# EasyEDA schematic Schematic.json
TITLE: Sheet_1; REV: 1.0; Date: 2025-03-10; Sheet: 1/1; Drawn By: beckett.gregory.taylor; Company: Your Company
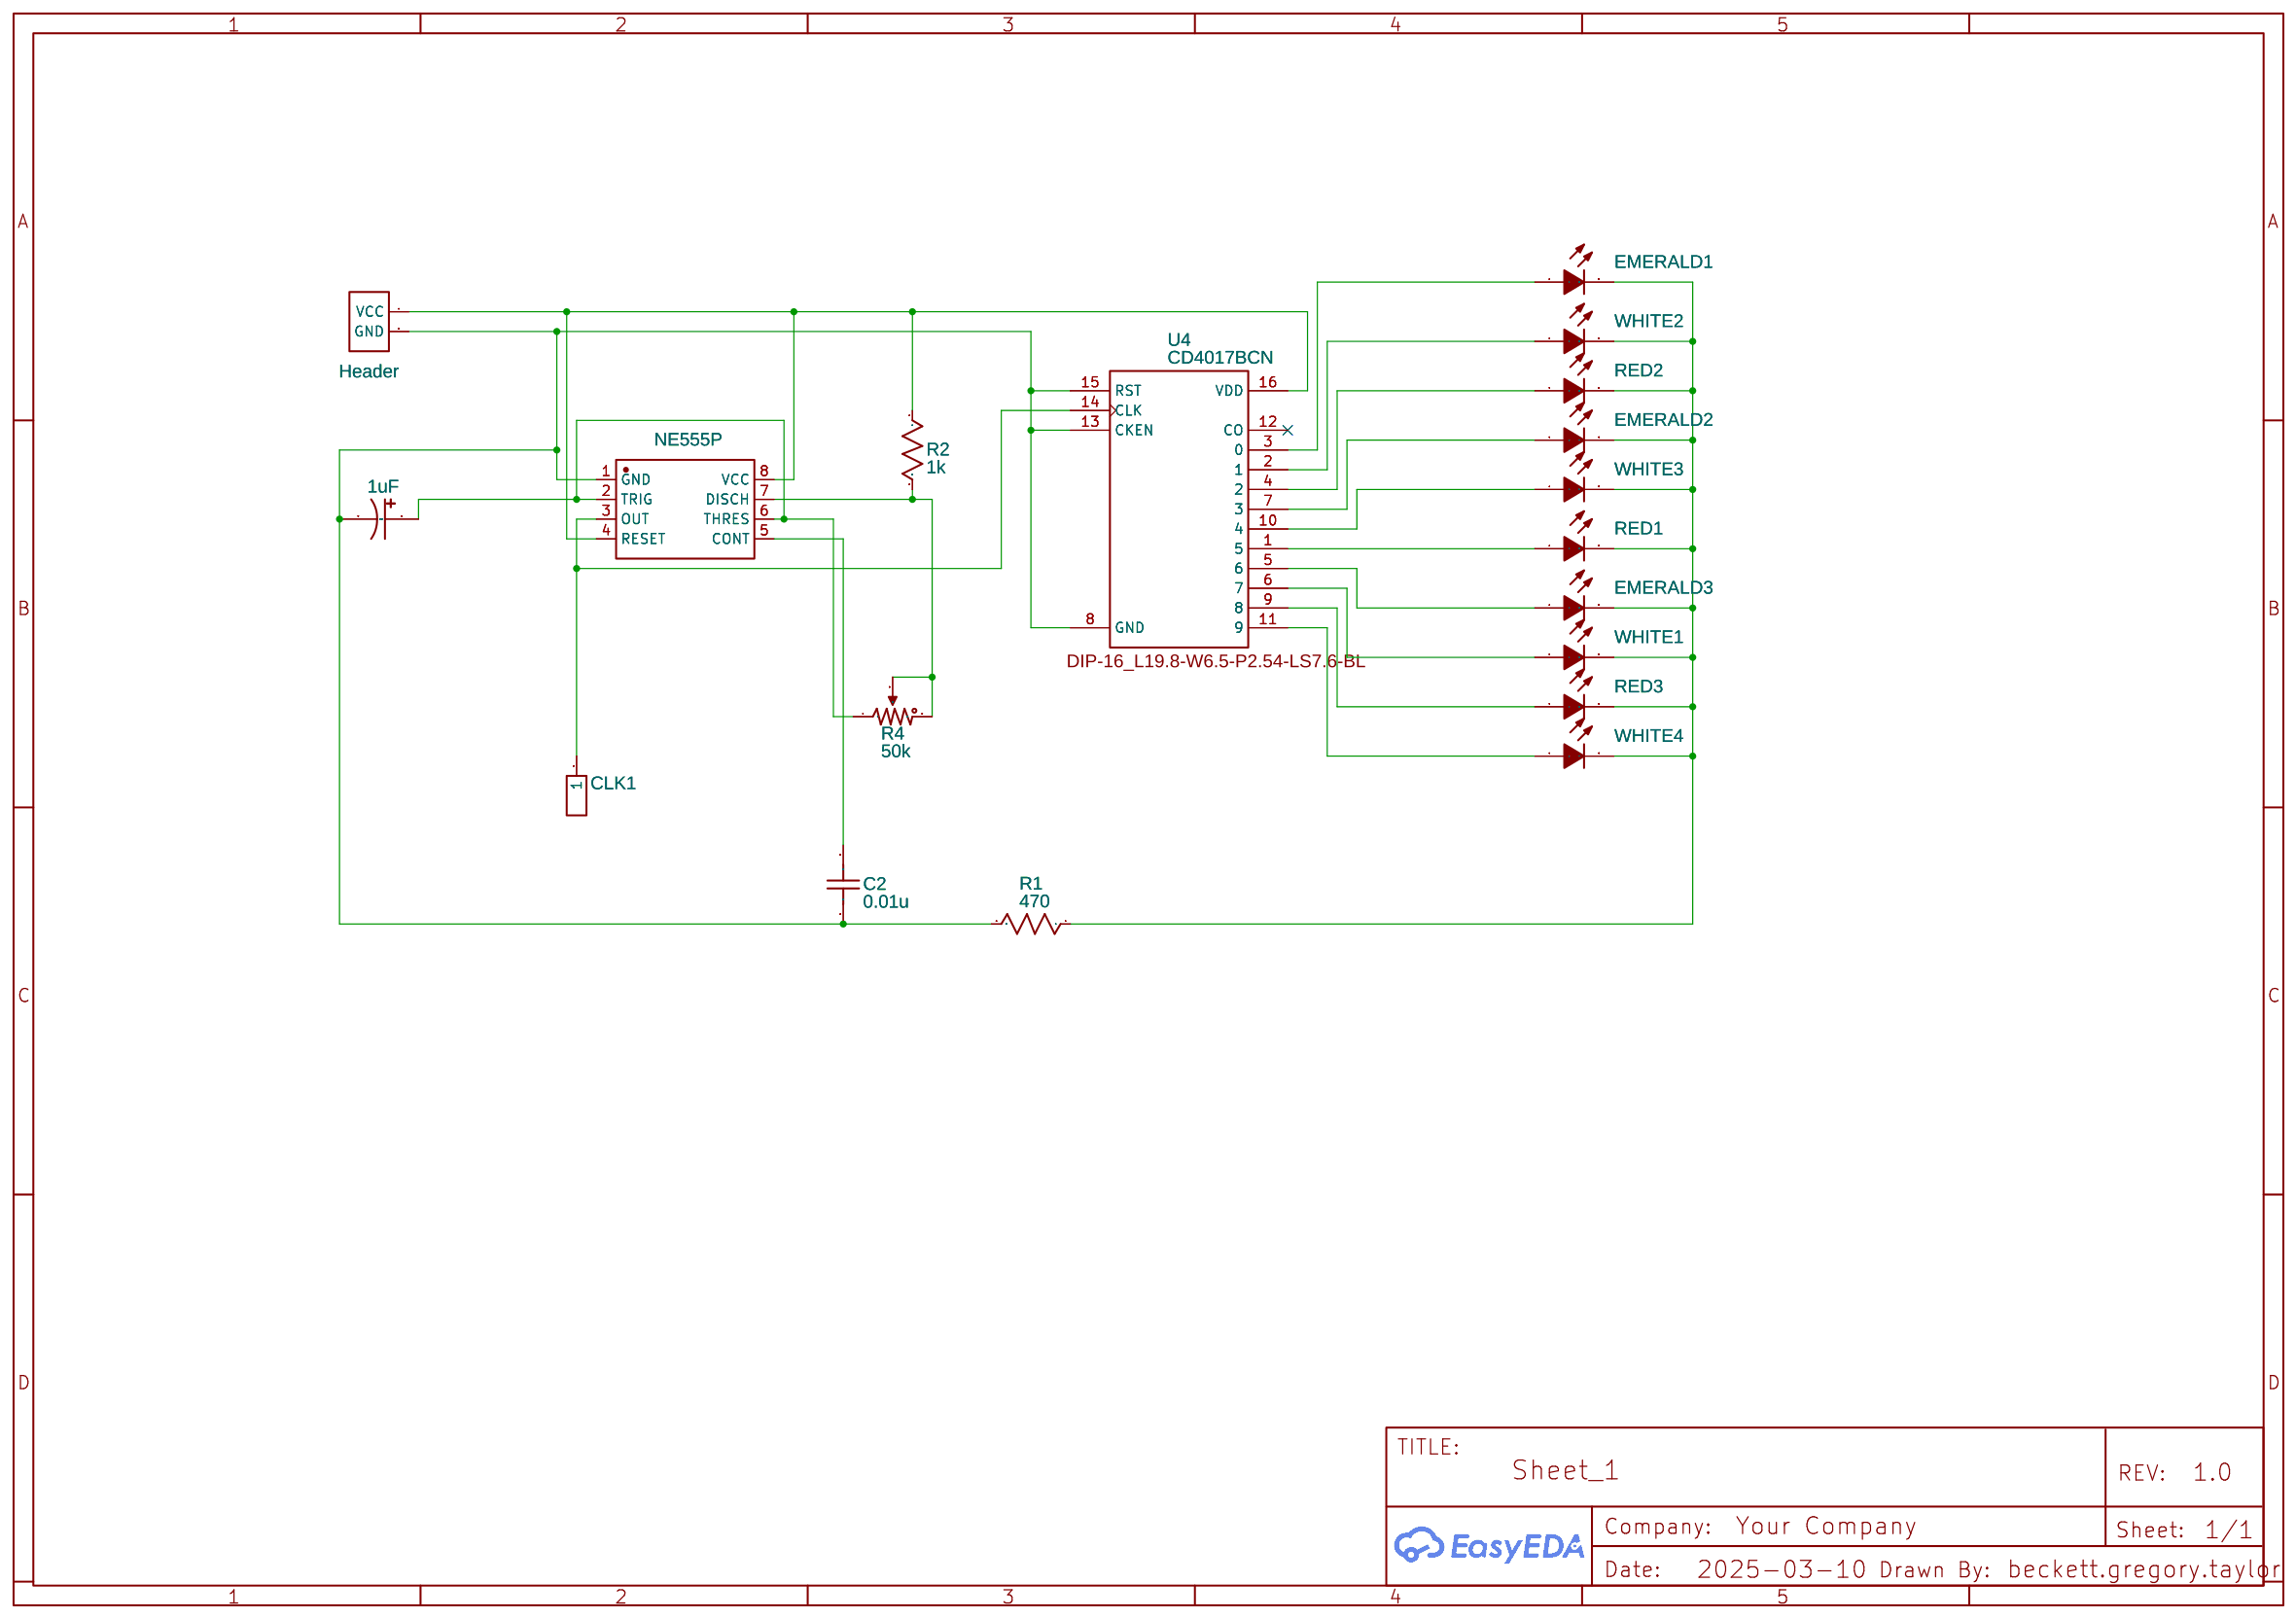
[diagram p0: schematic sheet]

## Parts
C1  1uF  [CAP-TH_BD5.0-P2.00-D0.8-FD]
C2  0.01u  [C0603]
CLK1  C81276  [HDR-TH_1P-P2.54-V-M]
EMERALD1  LED_5MM  [LED-TH_BD5.0-P2.54-FD_C9900023552]
EMERALD2  LED_5MM  [LED-TH_BD5.0-P2.54-FD_C9900023552]
EMERALD3  LED_5MM  [LED-TH_BD5.0-P2.54-FD_C9900023552]
H1  Header  [HDR-M-2.54_1X2]
R1  470  [R_AXIAL-0.3]
R2  1k  [R_AXIAL-0.3]
R4  50k  [RES-ADJ-3296X]
RED1  LED_5MM  [LED-TH_BD5.0-P2.54-FD_C9900023552]
RED2  LED_5MM  [LED-TH_BD5.0-P2.54-FD_C9900023552]
RED3  LED_5MM  [LED-TH_BD5.0-P2.54-FD_C9900023552]
U2  NE555P  [DIP-8_L9.8-W6.6-P2.54-LS7.6-BL]
U4  CD4017BCN  [DIP-16_L19.8-W6.5-P2.54-LS7.6-BL]
WHITE1  LED_5MM  [LED-TH_BD5.0-P2.54-FD_C9900023552]
WHITE2  LED_5MM  [LED-TH_BD5.0-P2.54-FD_C9900023552]
WHITE3  LED_5MM  [LED-TH_BD5.0-P2.54-FD_C9900023552]
WHITE4  LED_5MM  [LED-TH_BD5.0-P2.54-FD_C9900023552]

## Library data of the parts
C1 = UVZ1H010MDD: Contributor: LCSC; Supplier: LCSC; Supplier Part: C62934; Manufacturer: Nichicon(尼吉康)
C2 = C_0603_US: Supplier Part: C136131; Supplier: LCSC; Contributor: LCEDA_Lib
CLK1 = Header-Male-2.54_1x1: Supplier: LCSC; Manufacturer Part: 2.54-1*1P针; JLCPCB Part Class: Extended Part; Package Display: No; Manufacturer: BOOMELE(Boom Precision Elec); Contributor: Thejo Prakash
EMERALD1-EMERALD3 = LED_5MM: Contributor: lcsc; Supplier: LCSC; Supplier Part: C2895483
H1 = HEADER-FEMALE-2.54_1X2: Contributor: nonstop2004; Supplier: LCSC; Supplier Part: C492401; Package Display: No
R1 = Resistor: Manufacturer Part: ?; Supplier Part: C58592; Supplier: LCSC
R2 = Resistor: Manufacturer Part: ?; Supplier Part: C713997; Supplier: LCSC
R4 = Potentiometer: K(%): 50; Manufacturer Part: ?; Supplier: LCSC; Supplier Part: C118912; Package Display: No
RED1-RED3 = LED_5MM: Contributor: lcsc; Supplier: LCSC; Supplier Part: C2844743
U2 = NE555P: Supplier: LCSC; Manufacturer: TI(德州仪器); Supplier Part: C46749; JLCPCB Part Class: Extended Part
U4 = CD4017BCN: Decade CounterDivider with 10 Decoded Outputs; Supplier: LCSC; Supplier Part: C32710674; Package Display: Yes
WHITE1-WHITE4 = LED_5MM: Contributor: lcsc; Supplier: LCSC; Supplier Part: C2895480

## Nets
Net-(C1-1): C1.1 R4.1 U2.2(TRIG) U2.6(THRES)
Net-(C1-2): C1.2 C2.1 H1.2(GND) R1.2 U2.1(GND) U4.8(GND) U4.13(CKEN) U4.15(RST)
Net-(C2-2): C2.2 U2.5(CONT)
Net-(CLK1-1): CLK1.1 U2.3(OUT) U4.14(CLK)
Net-(EMERALD1-1): EMERALD1.1(A) U4.3(0)
Net-(EMERALD1-2): EMERALD1.2(K) EMERALD2.2(K) EMERALD3.2(K) R1.1 RED1.2(K) RED2.2(K) RED3.2(K) WHITE1.2(K) WHITE2.2(K) WHITE3.2(K) WHITE4.2(K)
Net-(EMERALD2-1): EMERALD2.1(A) U4.7(3)
Net-(EMERALD3-1): EMERALD3.1(A) U4.5(6)
Net-(H1-1): H1.1(VCC) R2.1 U2.4(RESET) U2.8(VCC) U4.16(VDD)
Net-(R2-2): R2.2 R4.2(3) R4.3(2) U2.7(DISCH)
Net-(RED1-1): RED1.1(A) U4.1(5)
Net-(RED2-1): RED2.1(A) U4.4(2)
Net-(RED3-1): RED3.1(A) U4.9(8)
Net-(U4-2): U4.2(1) WHITE2.1(A)
Net-(U4-6): U4.6(7) WHITE1.1(A)
Net-(U4-10): U4.10(4) WHITE3.1(A)
Net-(U4-11): U4.11(9) WHITE4.1(A)

Not connected (* = marked no-connect by the designer): U4 12(CO)*
